# Altium project QUTMS-RADIO-GPS-V00.PrjPcb
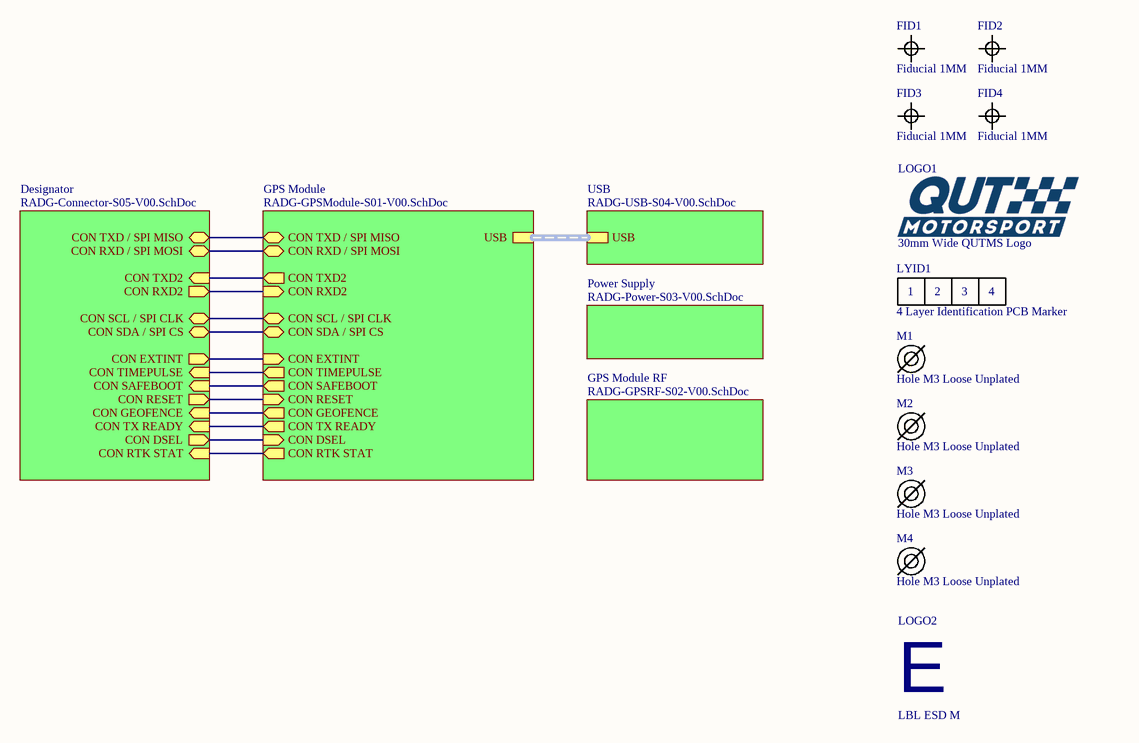
[diagram p0: RADG-Master-S00-V00.SchDoc]
6 sheets, 106 parts. Net scope: hierarchical (ports join the sheet entries above them; power ports are global).
Board file: RADG-B00-V00.PcbDoc
Sheets:
  RADG-Master-S00-V00.SchDoc
    GPS Module = RADG-GPSModule-S01-V00.SchDoc
    Power Supply = RADG-Power-S03-V00.SchDoc
    USB = RADG-USB-S04-V00.SchDoc
    Designator = RADG-Connector-S05-V00.SchDoc
    GPS Module RF = RADG-GPSRF-S02-V00.SchDoc

## Sheet RADG-Master-S00-V00.SchDoc: RADG Master (Top Level)
size A3; DrawnBy: Jonn Dillon; DocumentNumber: 1; SheetNumber: 1; SheetTotal: 6; Version: 00; Project: QUTMS RADIO GPS; PageSetup: Record=PageOptions|CenterHorizontal=True|CenterVertical=True|PrintScale=0.97|XCorrection=1.00|YCorrection=1.00|PrintKind=0|BorderSize=5000000|LeftOffset=0|BottomOffset=0|Orientation=2|PaperLength=1000|PaperWidth=1000|Scale=100|PaperSource=7|PrintQuality=-4|MediaType=1|DitherType=10|PaperKind=A4|PrintScaleMode=1

### Parts
FID1  Fiducial 1MM  [FIDUCIAL 1MM]  (no BOM)
FID2  Fiducial 1MM  [FIDUCIAL 1MM]  (no BOM)
FID3  Fiducial 1MM  [FIDUCIAL 1MM]  (no BOM)
FID4  Fiducial 1MM  [FIDUCIAL 1MM]  (no BOM)
LOGO1  30mm Wide QUTMS Logo  [QUTMS LOGO 30MM]  (no BOM)
LOGO2  LBL ESD M  [LBL ESD MEDIUM]  (no BOM)
LYID1  4 Layer Identification PCB Marker  [LAYER IDENT 4]  (no BOM)
M1  Hole M3 Loose Unplated  [M3.5 UNPLATED]  (no BOM)
M2  Hole M3 Loose Unplated  [M3.5 UNPLATED]  (no BOM)
M3  Hole M3 Loose Unplated  [M3.5 UNPLATED]  (no BOM)
M4  Hole M3 Loose Unplated  [M3.5 UNPLATED]  (no BOM)

### Sub-sheets
Designator = RADG-Connector-S05-V00.SchDoc: CON TXD / SPI MISO (bidir), CON RXD / SPI MOSI (bidir), CON TXD2 (in), CON RXD2 (out), CON SCL / SPI CLK (bidir), CON SDA / SPI CS (bidir), CON EXTINT (out), CON TIMEPULSE (in), CON SAFEBOOT (in), CON RESET (out), CON GEOFENCE (in), CON TX READY (in), CON DSEL (out), CON RTK STAT (in)
GPS Module = RADG-GPSModule-S01-V00.SchDoc: USB (harness USB), CON TX READY (out), CON DSEL (in), CON RTK STAT (out), CON SCL / SPI CLK (bidir), CON RXD2 (in), CON RESET (in), CON GEOFENCE (out), CON TXD2 (out), CON EXTINT (in), CON TIMEPULSE (out), CON SAFEBOOT (out), CON SDA / SPI CS (bidir), CON RXD / SPI MOSI (bidir), CON TXD / SPI MISO (bidir)
GPS Module RF = RADG-GPSRF-S02-V00.SchDoc: no entries
Power Supply = RADG-Power-S03-V00.SchDoc: no entries
USB = RADG-USB-S04-V00.SchDoc: USB

### Nets
CON DSEL: sheet GPS Module/CON DSEL, sheet Designator/CON DSEL
CON EXTINT: sheet GPS Module/CON EXTINT, sheet Designator/CON EXTINT
CON GEOFENCE: sheet GPS Module/CON GEOFENCE, sheet Designator/CON GEOFENCE
CON RESET: sheet GPS Module/CON RESET, sheet Designator/CON RESET
CON RTK STAT: sheet GPS Module/CON RTK STAT, sheet Designator/CON RTK STAT
CON RXD2: sheet GPS Module/CON RXD2, sheet Designator/CON RXD2
CON RXD / SPI MOSI: sheet GPS Module/CON RXD / SPI MOSI, sheet Designator/CON RXD / SPI MOSI
CON SAFEBOOT: sheet GPS Module/CON SAFEBOOT, sheet Designator/CON SAFEBOOT
CON SCL / SPI CLK: sheet GPS Module/CON SCL / SPI CLK, sheet Designator/CON SCL / SPI CLK
CON SDA / SPI CS: sheet GPS Module/CON SDA / SPI CS, sheet Designator/CON SDA / SPI CS
CON TIMEPULSE: sheet GPS Module/CON TIMEPULSE, sheet Designator/CON TIMEPULSE
CON TX READY: sheet GPS Module/CON TX READY, sheet Designator/CON TX READY
CON TXD2: sheet GPS Module/CON TXD2, sheet Designator/CON TXD2
CON TXD / SPI MISO: sheet GPS Module/CON TXD / SPI MISO, sheet Designator/CON TXD / SPI MISO

### Buses and harness runs
harness sheet GPS Module/USB = sheet USB/USB

### Notes on the sheet
- Revision History:
- Sheet Title:
- Rev
- Date
- Description
- Project:
- Size:
- Drawn By:
- A3
- Number:
- Revision:
- Sheet
- Version:
- of
- QUT Motorsport
- O-120, Gardens Point
- 2 George Street
- Brisbane, QLD 4000
- Australia
- Print Date:
- Print Time:
- File Name:
- (in symbol Layer Identification 4) 1; 2; 3; 4
- (in symbol LBL ESD M) E

### Library data of the parts
LOGO1 = QUTMS Logo 30mm
LYID1 = Layer Identification 4
M1-M4 = Hole M3 Loose Unplated: M3.5 Hole, No Plating

## Sheet RADG-GPSModule-S01-V00.SchDoc: RADG GPS Module (ZED-F9#, Powered Antenna)
size A3; DrawnBy: Jonn Dillon; DocumentNumber: 2; SheetNumber: 2; SheetTotal: 6; Version: 00; Project: QUTMS RADIO GPS; PageSetup: Record=PageOptions|CenterHorizontal=True|CenterVertical=True|PrintScale=0.97|XCorrection=1.00|YCorrection=1.00|PrintKind=0|BorderSize=5000000|LeftOffset=0|BottomOffset=0|Orientation=2|PaperLength=1000|PaperWidth=1000|Scale=100|PaperSource=7|PrintQuality=-4|MediaType=1|DitherType=10|PaperKind=A4|PrintScaleMode=1
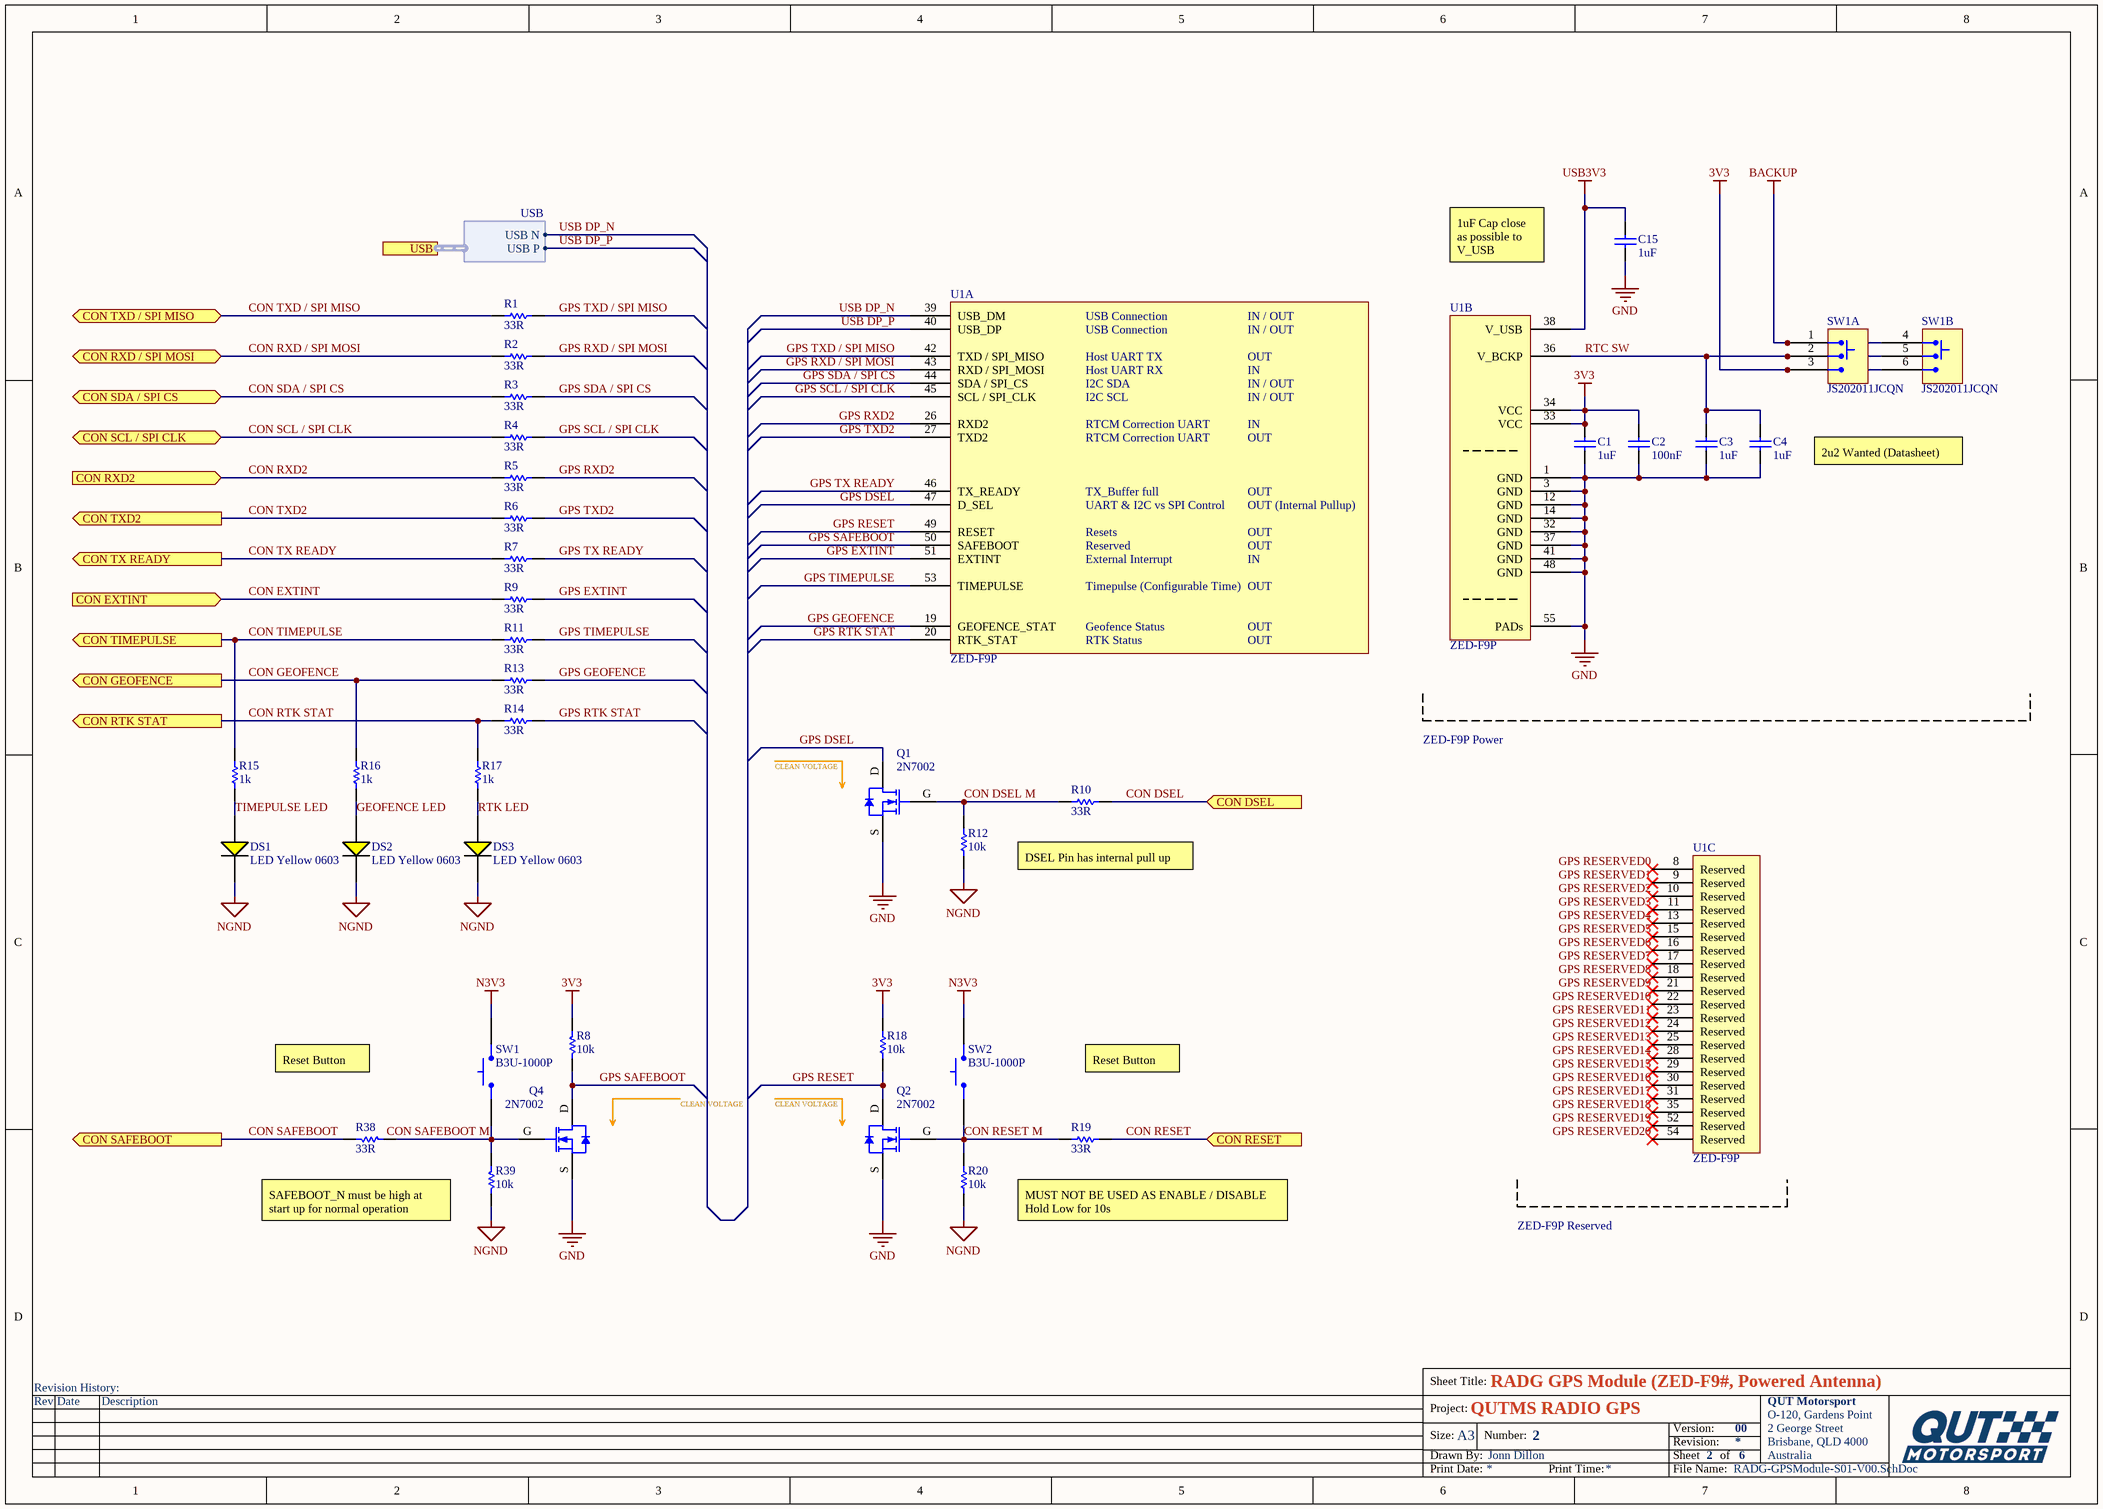
[diagram p1: RADG-GPSModule-S01-V00.SchDoc]

### Parts
(Parts that share a designator on the sheet are numbered #1, #2 ... from top to bottom, then left to right.)
C1  1uF  [Cap_Ceramic_0603]
C2  100nF  [Cap_Ceramic_0603]
C3  1uF  [Cap_Ceramic_0603]
C4  1uF  [Cap_Ceramic_0603]
C15  1uF  [Cap_Ceramic_0603]
DS1  LED Yellow 0603  [LED YELLOW 0603]
DS2  LED Yellow 0603  [LED YELLOW 0603]
DS3  LED Yellow 0603  [LED YELLOW 0603]
Q1  2N7002  [SOT23-3]
Q2  2N7002  [SOT23-3]
Q4  2N7002  [SOT23-3]
R1  33R  [Res_ThinFilm_0603]
R2  33R  [Res_ThinFilm_0603]
R3  33R  [Res_ThinFilm_0603]
R4  33R  [Res_ThinFilm_0603]
R5  33R  [Res_ThinFilm_0603]
R6  33R  [Res_ThinFilm_0603]
R7  33R  [Res_ThinFilm_0603]
R8  10k  [Res_ThinFilm_0603]
R9  33R  [Res_ThinFilm_0603]
R10  33R  [Res_ThinFilm_0603]
R11  33R  [Res_ThinFilm_0603]
R12  10k  [Res_ThinFilm_0603]
R13  33R  [Res_ThinFilm_0603]
R14  33R  [Res_ThinFilm_0603]
R15  1k  [Res_ThinFilm_0603]
R16  1k  [Res_ThinFilm_0603]
R17  1k  [Res_ThinFilm_0603]
R18  10k  [Res_ThinFilm_0603]
R19  33R  [Res_ThinFilm_0603]
R20  10k  [Res_ThinFilm_0603]
R38  33R  [Res_ThinFilm_0603]
R39  10k  [Res_ThinFilm_0603]
SW1#1  JS202011JCQN  [JS202011JCQN]  (parts A,B of 2)
SW1#2  B3U-1000P  [BTN B3U-1000P]
SW2  B3U-1000P  [BTN B3U-1000P]
U1  ZED-F9P  [uBlox_ZED-F9P]  (parts A,B,C of 4)

### Ports
CON DSEL (in), CON EXTINT (in), CON GEOFENCE (out), CON RESET (in), CON RTK STAT (out), CON RXD2 (in), CON RXD / SPI MOSI (bidir), CON SAFEBOOT (out), CON SCL / SPI CLK (bidir), CON SDA / SPI CS (bidir), CON TIMEPULSE (out), CON TX READY (out), CON TXD2 (out), CON TXD / SPI MISO (bidir), USB (harness USB)

### Harnesses
USB: USB P, USB N

### Nets
3V3: C1.2 C2.2 R8.2 R18.2 SW1#1.3 SW1#1.6 U1.33(VCC) U1.34(VCC)
BACKUP: SW1#1.1 SW1#1.4
GND: C1.1 C2.1 C3.1 C4.1 C15.1 Q1.S Q2.S Q4.S U1.1(GND) U1.3(GND) U1.12(GND) U1.14(GND) U1.32(GND) U1.37(GND) U1.41(GND) U1.48(GND) U1.55(PADs)
N3V3: SW1#2.2 SW2.2
NGND: DS1.2(C) DS2.2(C) DS3.2(C) R12.1 R20.1 R39.1
USB3V3: C15.2 U1.38(V_USB)
CON DSEL: R10.2 ; port CON DSEL
CON DSEL M: Q1.G R10.1 R12.2
CON EXTINT: R9.1 ; port CON EXTINT
CON GEOFENCE: R13.1 R16.2 ; port CON GEOFENCE
CON RESET: R19.2 ; port CON RESET
CON RESET M: Q2.G R19.1 R20.2 SW2.1
CON RTK STAT: R14.1 R17.2 ; port CON RTK STAT
CON RXD2: R5.1 ; port CON RXD2
CON RXD / SPI MOSI: R2.1 ; port CON RXD / SPI MOSI
CON SAFEBOOT: R38.2 ; port CON SAFEBOOT
CON SAFEBOOT M: Q4.G R38.1 R39.2 SW1#2.1
CON SCL / SPI CLK: R4.1 ; port CON SCL / SPI CLK
CON SDA / SPI CS: R3.1 ; port CON SDA / SPI CS
CON TIMEPULSE: R11.1 R15.2 ; port CON TIMEPULSE
CON TX READY: R7.1 ; port CON TX READY
CON TXD2: R6.1 ; port CON TXD2
CON TXD / SPI MISO: R1.1 ; port CON TXD / SPI MISO
GEOFENCE LED: DS2.1(A) R16.1
GPS DSEL: Q1.D U1.47(D_SEL)
GPS EXTINT: R9.2 U1.51(EXTINT)
GPS GEOFENCE: R13.2 U1.19(GEOFENCE_STAT)
GPS RESERVED0: U1.8(Reserved)
GPS RESERVED1: U1.9(Reserved)
GPS RESERVED2: U1.10(Reserved)
GPS RESERVED3: U1.11(Reserved)
GPS RESERVED4: U1.13(Reserved)
GPS RESERVED5: U1.15(Reserved)
GPS RESERVED6: U1.16(Reserved)
GPS RESERVED7: U1.17(Reserved)
GPS RESERVED8: U1.18(Reserved)
GPS RESERVED9: U1.21(Reserved)
GPS RESERVED10: U1.22(Reserved)
GPS RESERVED11: U1.23(Reserved)
GPS RESERVED12: U1.24(Reserved)
GPS RESERVED13: U1.25(Reserved)
GPS RESERVED14: U1.28(Reserved)
GPS RESERVED15: U1.29(Reserved)
GPS RESERVED16: U1.30(Reserved)
GPS RESERVED17: U1.31(Reserved)
GPS RESERVED18: U1.35(Reserved)
GPS RESERVED19: U1.52(Reserved)
GPS RESERVED20: U1.54(Reserved)
GPS RESET: Q2.D R18.1 U1.49(RESET)
GPS RTK STAT: R14.2 U1.20(RTK_STAT)
GPS RXD2: R5.2 U1.26(RXD2)
GPS RXD / SPI MOSI: R2.2 U1.43(RXD_/_SPI_MOSI)
GPS SAFEBOOT: Q4.D R8.1 U1.50(SAFEBOOT)
GPS SCL / SPI CLK: R4.2 U1.45(SCL_/_SPI_CLK)
GPS SDA / SPI CS: R3.2 U1.44(SDA_/_SPI_CS)
GPS TIMEPULSE: R11.2 U1.53(TIMEPULSE)
GPS TX READY: R7.2 U1.46(TX_READY)
GPS TXD2: R6.2 U1.27(TXD2)
GPS TXD / SPI MISO: R1.2 U1.42(TXD_/_SPI_MISO)
RTC SW: C3.2 C4.2 SW1#1.2 SW1#1.5 U1.36(V_BCKP)
RTK LED: DS3.1(A) R17.1
TIMEPULSE LED: DS1.1(A) R15.1
USB DP_N: U1.39(USB_DM) ; port USB.USB N
USB DP_P: U1.40(USB_DP) ; port USB.USB P

### Notes on the sheet
- 1uF Cap close as possible to V_USB
- 2u2 Wanted (Datasheet)
- CLEAN VOLTAGE
- ZED-F9P Power
- DSEL Pin has internal pull up
- Reset Button
- SAFEBOOT_N must be high at start up for normal operation
- MUST NOT BE USED AS ENABLE / DISABLE
  Hold Low for 10s
- ZED-F9P Reserved
- Revision History:
- Sheet Title:
- Rev
- Date
- Description
- Project:
- Size:
- Drawn By:
- A3
- Number:
- Revision:
- Sheet
- Version:
- of
- QUT Motorsport
- O-120, Gardens Point
- 2 George Street
- Brisbane, QLD 4000
- Australia
- Print Date:
- Print Time:
- File Name:
- (in symbol ZED-F9P, part A) USB Connection; IN / OUT; Host UART TX; OUT; Host UART RX; IN; I2C SDA; I2C SCL; RTCM Correction UART; TX_Buffer full; UART & I2C vs SPI Control; OUT (Internal Pullup); Resets; External Interrupt; Timepulse (Configurable Time); Geofence Status; RTK Status

### Library data of the parts
C1 C3 C4 C15 = 1uF 25V 5% X7R 0603: Capacitor, Ceramic, SMD, 1uF, 25V, 5%, X7R, 0603
C2 = 100nF 50V 5% X7R 0603: Capacitor, Ceramic, SMD, 100nF, 50V, 5%, X7R, 0603
R1-R7 R9-R11 R13 R14 R19 R38 = 33R 5% 0603: Resistor, SMD, 33R, 0.1W, 5%, 0603
R8 R12 R18 R20 R39 = 10k 5% 0603: Resistor, SMD, 10k, 0.1W, 5%, 0603
R15-R17 = 1k 5% 0603: Resistor, SMD, 1k, 0.1W, 5%, 0603
SW1#1 = SLIDE DPDT JS202011JCQN
SW1#2 SW2 = BTN B3U-1000P: Omron B3U-1000P Ultra Miniture Switch; ComponentLink1Description: LCSC; ComponentLink1URL: https://lcsc.com/product-detail/Tactile-Switches_BRIGHT-TSA063G50-250_C294565.html

## Sheet RADG-Power-S03-V00.SchDoc: RADG Power (Filtering, Power Sequencing, USB)
size A3; DrawnBy: Jonn Dillon; DocumentNumber: 3; SheetNumber: 5; SheetTotal: 6; Version: 00; Project: QUTMS RADIO GPS; PageSetup: Record=PageOptions|CenterHorizontal=True|CenterVertical=True|PrintScale=0.97|XCorrection=1.00|YCorrection=1.00|PrintKind=0|BorderSize=5000000|LeftOffset=0|BottomOffset=0|Orientation=2|PaperLength=1000|PaperWidth=1000|Scale=100|PaperSource=7|PrintQuality=-4|MediaType=1|DitherType=10|PaperKind=A4|PrintScaleMode=1
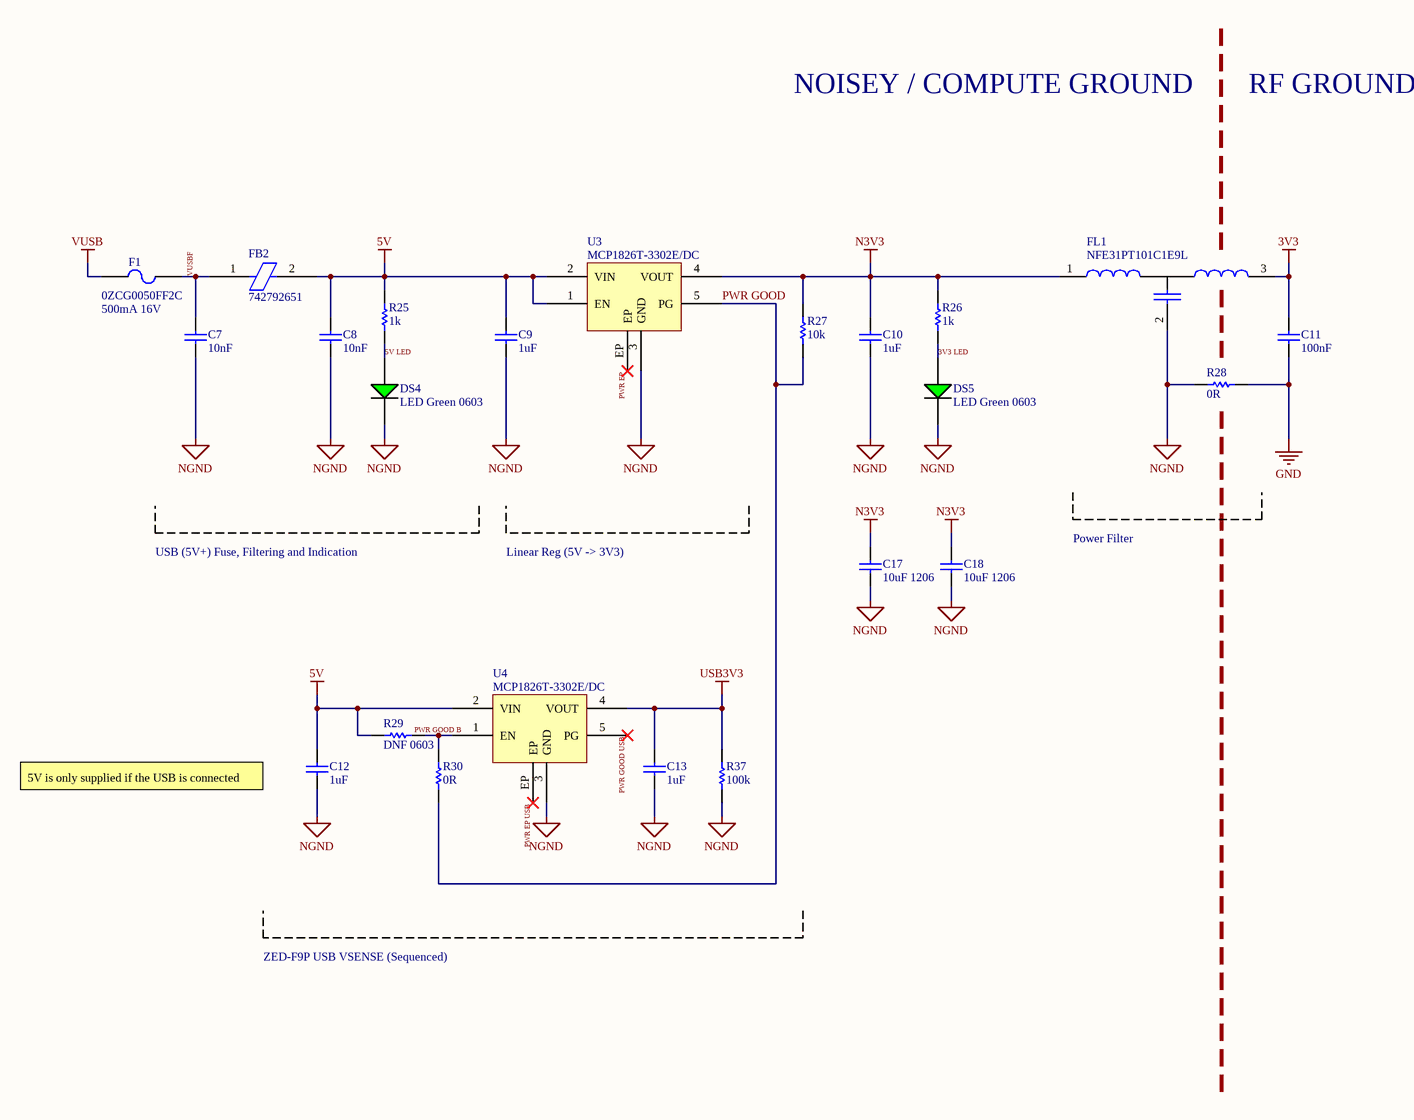
[diagram p2: RADG-Power-S03-V00.SchDoc]

### Parts
C7  10nF  [Cap_Ceramic_0603]
C8  10nF  [Cap_Ceramic_0603]
C9  1uF  [Cap_Ceramic_0603]
C10  1uF  [Cap_Ceramic_0603]
C11  100nF  [Cap_Ceramic_0603]
C12  1uF  [Cap_Ceramic_0603]
C13  1uF  [Cap_Ceramic_0603]
C17  10uF 1206  [Cap_Ceramic_1206]
C18  10uF 1206  [Cap_Ceramic_1206]
DS4  LED Green 0603  [LED GREEN 0603]
DS5  LED Green 0603  [LED GREEN 0603]
F1  0ZCG0050FF2C  [1812 FUSE]
FB2  742792651  [Inductor_0603]
FL1  NFE31PT101C1E9L  [NFE31PT101C1E9L]
R25  1k  [Res_ThinFilm_0603]
R26  1k  [Res_ThinFilm_0603]
R27  10k  [Res_ThinFilm_0603]
R28  0R  [Res_ThinFilm_0603]
R29  DNF 0603  [Res_ThinFilm_0603]
R30  0R  [Res_ThinFilm_0603]
R37  100k  [Res_ThinFilm_0603]
U3  MCP1826T-3302E/DC  [SOT-223-5]
U4  MCP1826T-3302E/DC  [SOT-223-5]

### Nets
3V3: C11.2 FL1.3
5V: C8.2 C9.2 C12.2 FB2.2 R25.2 R29.1 U3.1(EN) U3.2(VIN) U4.2(VIN)
GND: C11.1 R28.2
N3V3: C10.2 C17.2 C18.2 FL1.1 R26.2 R27.2 U3.4(VOUT)
NGND: C7.1 C8.1 C9.1 C10.1 C12.1 C13.1 C17.1 C18.1 DS4.2(C) DS5.2(C) FL1.2 R28.1 R37.1 U3.3(GND) U4.3(GND)
USB3V3: C13.2 R37.2 U4.4(VOUT)
VUSB: F1.1
3V3 LED: DS5.1(A) R26.1
5V LED: DS4.1(A) R25.1
PWR EP: U3.EP
PWR EP USB: U4.EP
PWR GOOD: R27.1 R30.1 U3.5(PG)
PWR GOOD B: R29.2 R30.2 U4.1(EN)
PWR GOOD USB: U4.5(PG)
VUSBF: C7.2 F1.2 FB2.1

### Notes on the sheet
- NOISEY / COMPUTE GROUND
- RF GROUND
- 500mA 16V
- USB (5V+) Fuse, Filtering and Indication
- Linear Reg (5V -> 3V3)
- Power Filter
- 5V is only supplied if the USB is connected
- ZED-F9P USB VSENSE (Sequenced)
- Revision History:
- Sheet Title:
- Rev
- Date
- Description
- Project:
- Size:
- Drawn By:
- A3
- Number:
- Revision:
- Sheet
- Version:
- of
- QUT Motorsport
- O-120, Gardens Point
- 2 George Street
- Brisbane, QLD 4000
- Australia
- Print Date:
- Print Time:
- File Name:

### Library data of the parts
C7 C8 = 10nF 50V 5% X7R 0603: Capacitor, Ceramic, SMD, 10nF, 50V, 5%, X7R, 0603
C9 C10 C12 C13 = 1uF 25V 5% X7R 0603: as C1 on sheet RADG-GPSModule-S01-V00
C11 = 100nF 50V 5% X7R 0603: as C2 on sheet RADG-GPSModule-S01-V00
C17 C18 = 10uF 25V 10% X7R 1206: Capacitor, Ceramic, SMD, 10uF, 25V, 10%, X7R, 1206
F1 = 0ZCG0050FF2C: Polymeric PTC Resettable Fuse 16V 500mA Ih Surface Mount 1812 (4532 Metric), Concave
FB2 = 742792651: 600 Ohms @ 100MHz 1 Signal Line Ferrite Bead 0603 (1608 Metric) 1A 200mOhm
FL1 = NFE31PT101C1E9L: LC (T-Type) EMI Filter 3rd Order Low Pass 1 Channel C = 100pF 6A 1206 (3216 Metric), 3 PC Pad
R25 R26 = 1k 5% 0603: Resistor, SMD, 1k, 0.1W, 5%, 0603
R27 = 10k 5% 0603: Resistor, SMD, 10k, 0.1W, 5%, 0603
R28 R30 = 0R 5% 0603: Resistor, SMD, 0R, 0.1W, 5%, 0603
R29 = DNF 0603: Resistor, SMD, DNF, 0.1W, 0603
R37 = 100k 5%, 0603: Resistor, SMD, 100k, 0.1W, 5%, 0603
U3 U4 = MCP1826T-3302E/DC: Linear Voltage Regulator IC Positive Fixed 1 Output 1A SOT-223-5

## Sheet RADG-USB-S04-V00.SchDoc: RADG USB (USB-C, ESD Protection)
size A3; DrawnBy: Jonn Dillon; DocumentNumber: 5; SheetNumber: 6; SheetTotal: 6; Version: 00; Project: QUTMS RADIO GPS; PageSetup: Record=PageOptions|CenterHorizontal=True|CenterVertical=True|PrintScale=0.97|XCorrection=1.00|YCorrection=1.00|PrintKind=0|BorderSize=5000000|LeftOffset=0|BottomOffset=0|Orientation=2|PaperLength=1000|PaperWidth=1000|Scale=100|PaperSource=7|PrintQuality=-4|MediaType=1|DitherType=10|PaperKind=A4|PrintScaleMode=1
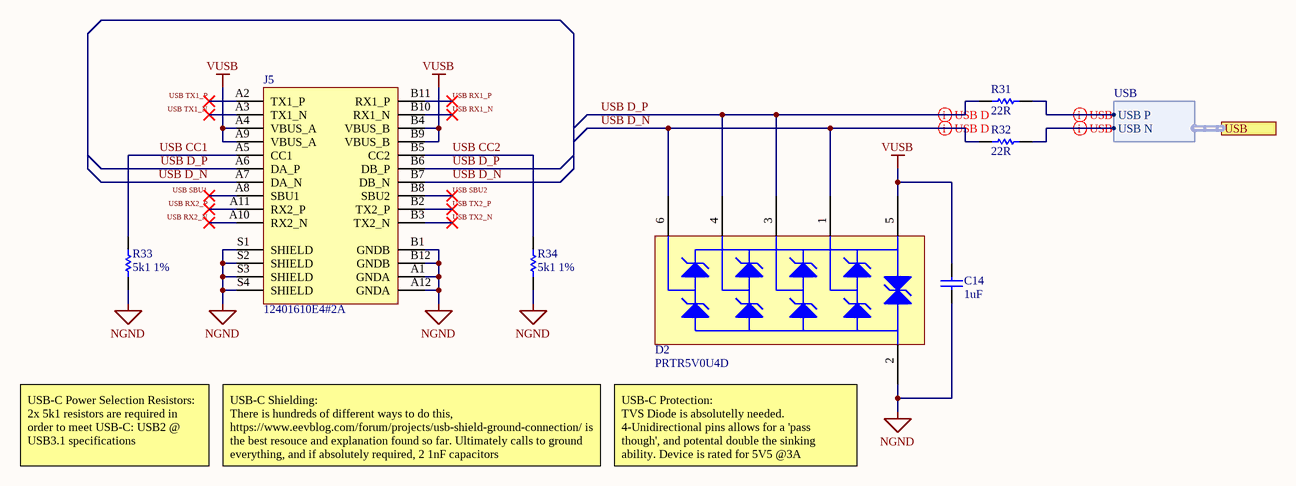
[diagram p3: RADG-USB-S04-V00.SchDoc]

### Parts
C14  1uF  [Cap_Ceramic_0603]
D2  PRTR5V0U4D  [SC-47]
J5  12401610E4#2A  [12401610E4#2A]
R31  22R  [Res_ThinFilm_0603]
R32  22R  [Res_ThinFilm_0603]
R33  5k1 1%  [Res_ThinFilm_0603]
R34  5k1 1%  [Res_ThinFilm_0603]

### Ports
USB (harness USB)

### Harnesses
USB: USB P, USB N

### Nets
NGND: C14.1 D2.2(GND) J5.A1(GNDA) J5.A12(GNDA) J5.B1(GNDB) J5.B12(GNDB) J5.S1(SHIELD) J5.S2(SHIELD) J5.S3(SHIELD) J5.S4(SHIELD) R33.1 R34.1
VUSB: C14.2 D2.5(VCC) J5.A4(VBUS_A) J5.A9(VBUS_A) J5.B4(VBUS_B) J5.B9(VBUS_B)
USB CC1: J5.A5(CC1) R33.2
USB CC2: J5.B5(CC2) R34.2
USB D_N: D2.1(P1) D2.6(P4) J5.A7(DA_N) J5.B7(DB_N) R32.1
USB D_P: D2.3(P2) D2.4(P3) J5.A6(DA_P) J5.B6(DB_P) R31.1
USB DP_N: R32.2 ; port USB.USB N
USB DP_P: R31.2 ; port USB.USB P
USB RX1_N: J5.B10(RX1_N)
USB RX1_P: J5.B11(RX1_P)
USB RX2_N: J5.A10(RX2_N)
USB RX2_P: J5.A11(RX2_P)
USB SBU1: J5.A8(SBU1)
USB SBU2: J5.B8(SBU2)
USB TX1_N: J5.A3(TX1_N)
USB TX1_P: J5.A2(TX1_P)
USB TX2_N: J5.B3(TX2_N)
USB TX2_P: J5.B2(TX2_P)

### Layout directives
differential pair: USB D_N, USB D_P, USB DP_N, USB DP_P

### Notes on the sheet
- USB-C Power Selection Resistors:
  2x 5k1 resistors are required in order to meet USB-C: USB2 @ USB3.1 specifications
- USB-C Shielding:
  There is hundreds of different ways to do this, https://www.eevblog.com/forum/projects/usb-shield-ground-connection/ is the best resouce and explanation found so far. Ultimately calls to ground everything, and if absolutely required, 2 1nF capacitors
- (near D2) USB-C Protection:
  TVS Diode is absolutelly needed. 4-Unidirectional pins allows for a 'pass though', and potental double the sinking ability. Device is rated for 5V5 @3A
- Revision History:
- Sheet Title:
- Rev
- Date
- Description
- Project:
- Size:
- Drawn By:
- A3
- Number:
- Revision:
- Sheet
- Version:
- of
- QUT Motorsport
- O-120, Gardens Point
- 2 George Street
- Brisbane, QLD 4000
- Australia
- Print Date:
- Print Time:
- File Name:

### Library data of the parts
C14 = 1uF 25V 5% X7R 0603: as C1 on sheet RADG-GPSModule-S01-V00
D2 = PRTR5V0U4D: Clamp Ipp Tvs Diode Surface Mount 6-TSOP
J5 = 12401610E4#2A: USB-C (USB TYPE-C) USB 3.2 Gen 2 (USB 3.1 Gen 2, Superspeed + (USB 3.1)) Receptacle Connector 24 Position Surface Mount, Right Angle; Through Hole
R31 R32 = 22R 5% 0603: Resistor, SMD, 22R, 0.1W, 5%, 0603
R33 R34 = 5k1 1% 0603: Resistor, SMD, 5k1, 0.1W, 1%, 0603

## Sheet RADG-Connector-S05-V00.SchDoc: RADG Connector (Logic Analyser Header, 60Pin 0.5mm FFC)
size A3; DrawnBy: Jonn Dillon; DocumentNumber: 4; SheetNumber: 3; SheetTotal: 6; Version: 00; Project: QUTMS RADIO GPS; PageSetup: Record=PageOptions|CenterHorizontal=True|CenterVertical=True|PrintScale=0.97|XCorrection=1.00|YCorrection=1.00|PrintKind=0|BorderSize=5000000|LeftOffset=0|BottomOffset=0|Orientation=2|PaperLength=1000|PaperWidth=1000|Scale=100|PaperSource=7|PrintQuality=-4|MediaType=1|DitherType=10|PaperKind=A4|PrintScaleMode=1
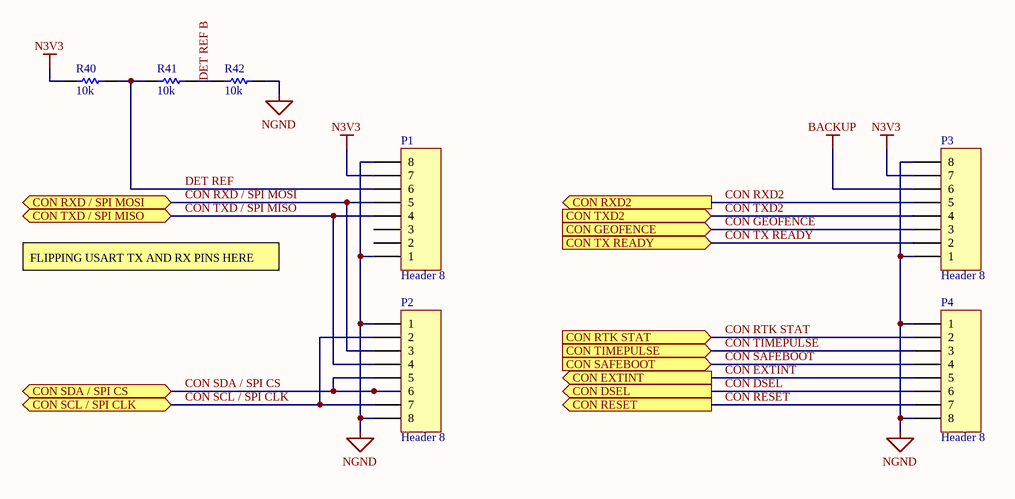
[diagram p4: RADG-Connector-S05-V00.SchDoc]

### Parts
P1  Header 8  [HDR1X8]
P2  Header 8  [HDR1X8]
P3  Header 8  [HDR1X8]
P4  Header 8  [HDR1X8]
R40  10k  [Res_ThinFilm_0603]
R41  10k  [Res_ThinFilm_0603]
R42  10k  [Res_ThinFilm_0603]

### Ports
CON DSEL (out), CON EXTINT (out), CON GEOFENCE (in), CON RESET (out), CON RTK STAT (in), CON RXD2 (out), CON RXD / SPI MOSI (bidir), CON SAFEBOOT (in), CON SCL / SPI CLK (bidir), CON SDA / SPI CS (bidir), CON TIMEPULSE (in), CON TX READY (in), CON TXD2 (in), CON TXD / SPI MISO (bidir)

### Nets
BACKUP: P3.6
N3V3: P1.7 P3.7 R40.1
NGND: P1.1 P1.8 P2.1 P2.8 P3.1 P3.8 P4.1 P4.8 R42.2
CON DSEL: P4.6 ; port CON DSEL
CON EXTINT: P4.5 ; port CON EXTINT
CON GEOFENCE: P3.3 ; port CON GEOFENCE
CON RESET: P4.7 ; port CON RESET
CON RTK STAT: P4.2 ; port CON RTK STAT
CON RXD2: P3.5 ; port CON RXD2
CON RXD / SPI MOSI: P1.5 P2.3 ; port CON RXD / SPI MOSI
CON SAFEBOOT: P4.4 ; port CON SAFEBOOT
CON SCL / SPI CLK: P2.2 P2.7 ; port CON SCL / SPI CLK
CON SDA / SPI CS: P2.5 P2.6 ; port CON SDA / SPI CS
CON TIMEPULSE: P4.3 ; port CON TIMEPULSE
CON TX READY: P3.2 ; port CON TX READY
CON TXD2: P3.4 ; port CON TXD2
CON TXD / SPI MISO: P1.4 P2.4 ; port CON TXD / SPI MISO
DET REF: P1.6 R40.2 R41.1
DET REF B: R41.2 R42.1

Not connected (* = marked no-connect by the designer): P1 2 3

### Notes on the sheet
- FLIPPING USART TX AND RX PINS HERE
- Revision History:
- Sheet Title:
- Rev
- Date
- Description
- Project:
- Size:
- Drawn By:
- A3
- Number:
- Revision:
- Sheet
- Version:
- of
- QUT Motorsport
- O-120, Gardens Point
- 2 George Street
- Brisbane, QLD 4000
- Australia
- Print Date:
- Print Time:
- File Name:

### Library data of the parts
P1-P4 = Header 8: Header, 8-Pin; LatestRevisionDate: 17-Jul-2002; LatestRevisionNote: Re-released for DXP Platform.; Publisher: Altium Limited
R40-R42 = 10k 5% 0603: Resistor, SMD, 10k, 0.1W, 5%, 0603

## Sheet RADG-GPSRF-S02-V00.SchDoc: RADG GPS Module RF (Powered Antenna, Det, Short Det, Shield)
size A3; DrawnBy: Jonn Dillon; DocumentNumber: 2; SheetNumber: 4; SheetTotal: 6; Version: 00; Project: QUTMS RADIO GPS; PageSetup: Record=PageOptions|CenterHorizontal=True|CenterVertical=True|PrintScale=0.97|XCorrection=1.00|YCorrection=1.00|PrintKind=0|BorderSize=5000000|LeftOffset=0|BottomOffset=0|Orientation=2|PaperLength=1000|PaperWidth=1000|Scale=100|PaperSource=7|PrintQuality=-4|MediaType=1|DitherType=10|PaperKind=A4|PrintScaleMode=1
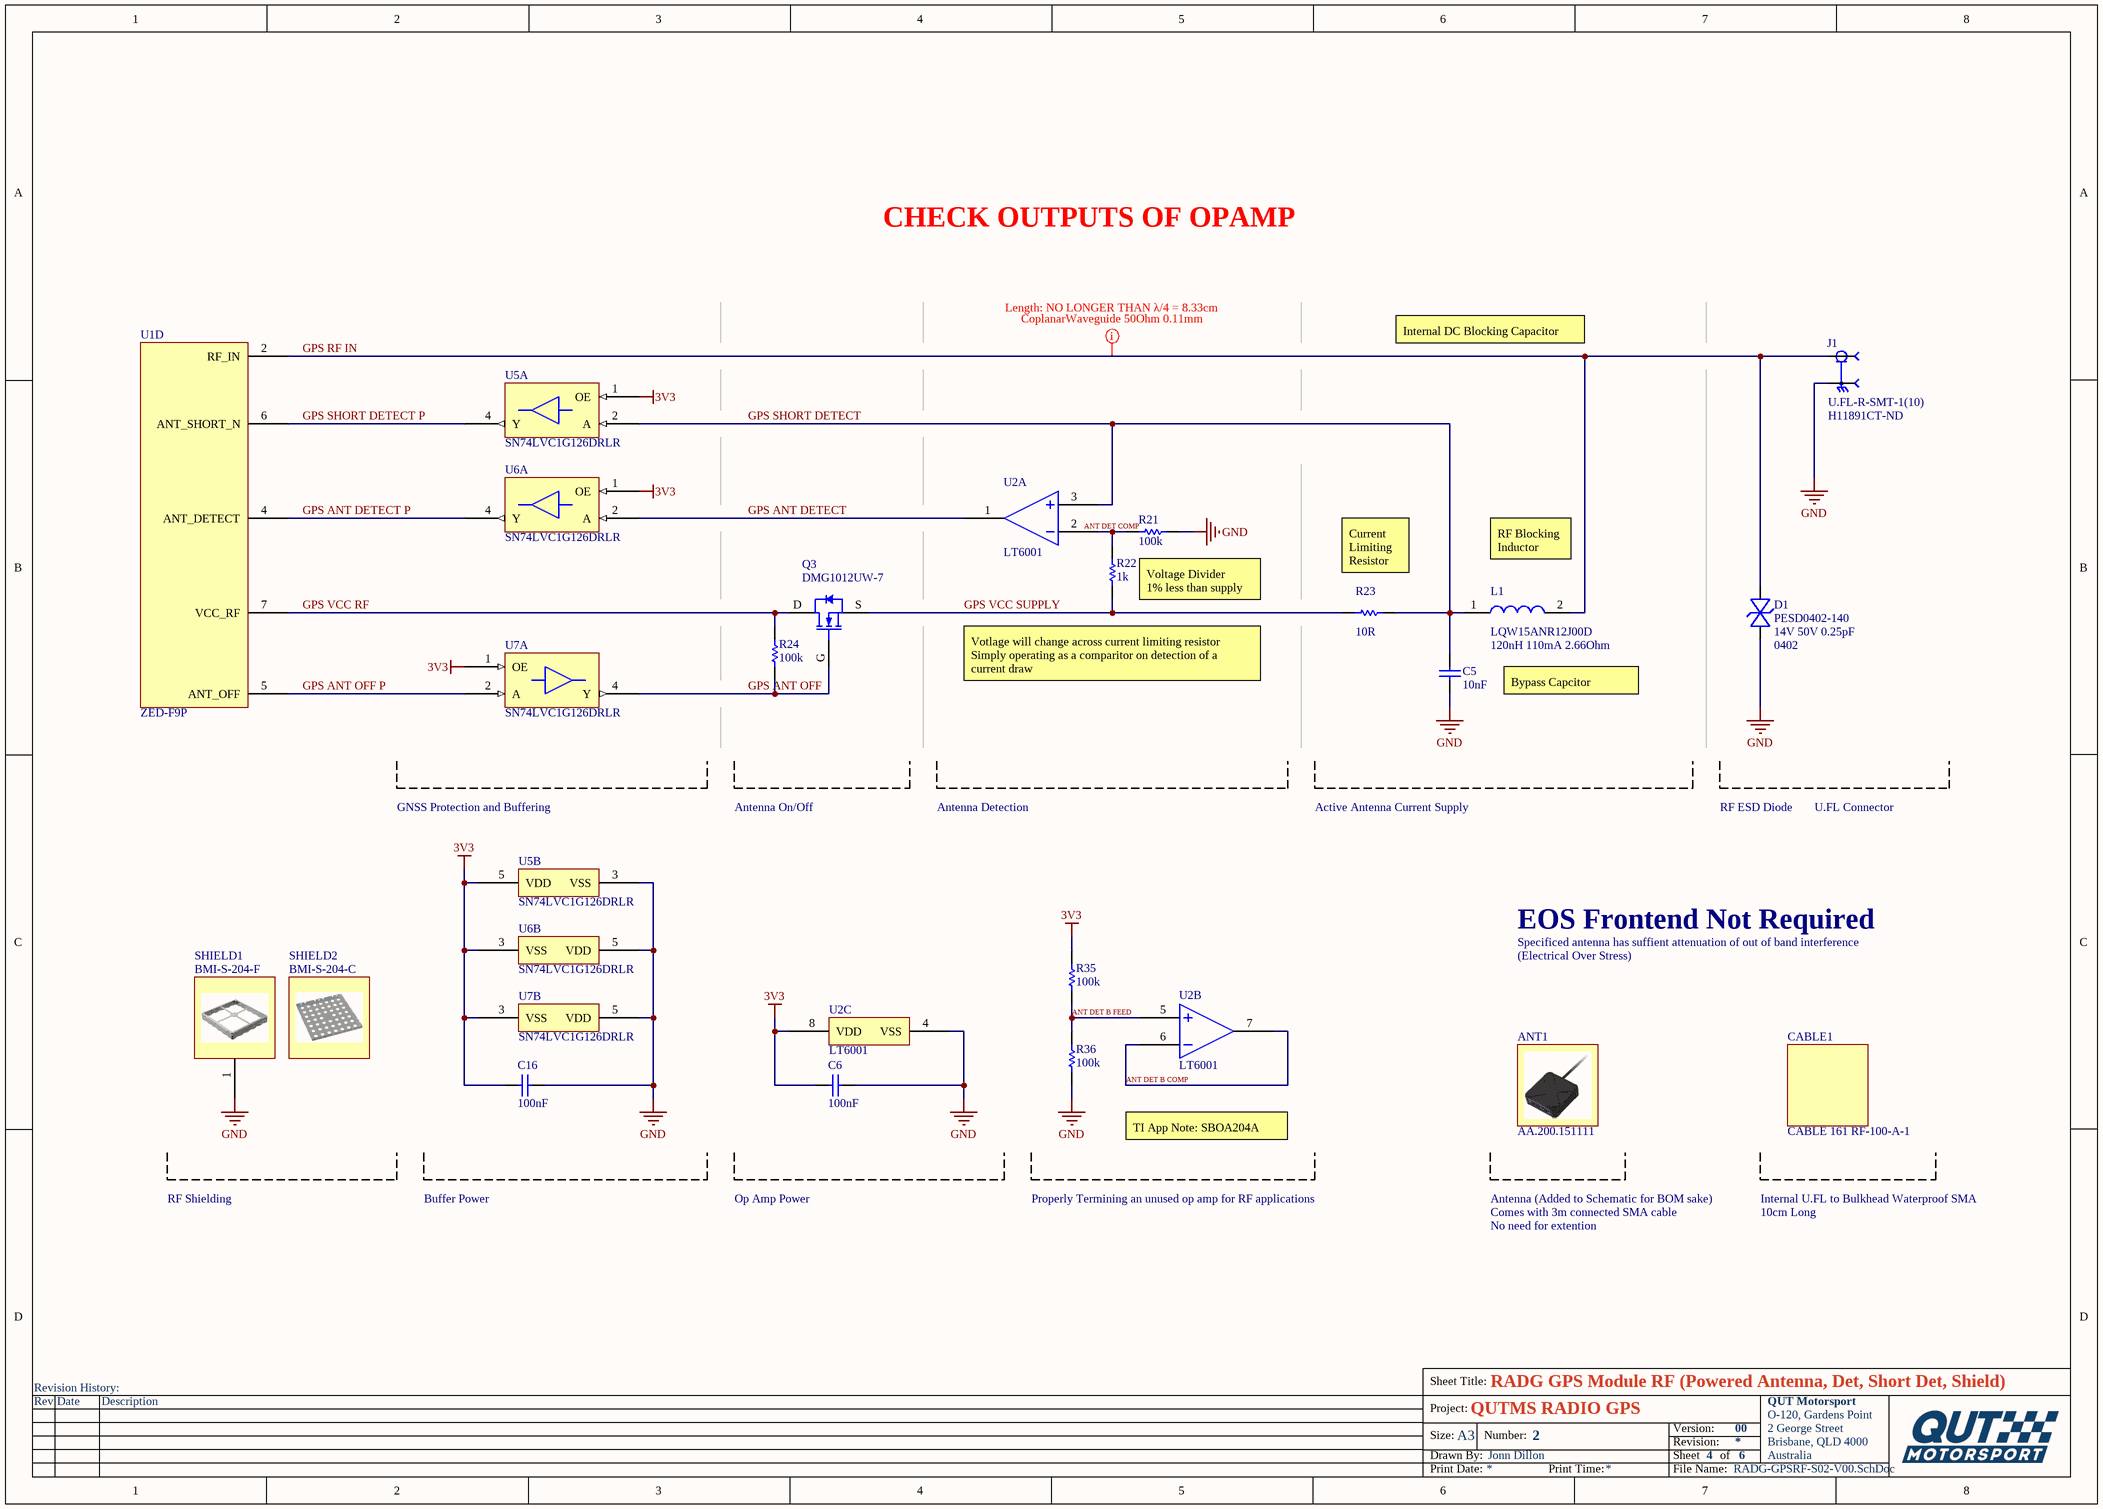
[diagram p5: RADG-GPSRF-S02-V00.SchDoc]

### Parts
ANT1  AA.200.151111
C5  10nF  [Cap_Ceramic_0603]
C6  100nF  [Cap_Ceramic_0603]
C16  100nF  [Cap_Ceramic_0603]
CABLE1  CABLE 161 RF-100-A-1
D1  PESD0402-140  [FERRITEBEAD_0402]
J1  U.FL-R-SMT-1(10)  [U.FL-R-SMT HIROSE]
L1  LQW15ANR12J00D  [FERRITEBEAD_0402]
Q3  DMG1012UW-7  [SC-70]
R21  100k  [Res_ThinFilm_0603]
R22  1k  [Res_ThinFilm_0603]
R23  10R  [Res_ThinFilm_0603]
R24  100k  [Res_ThinFilm_0603]
R35  100k  [Res_ThinFilm_0603]
R36  100k  [Res_ThinFilm_0603]
SHIELD1  BMI-S-204-F  [BMI-S-204-F]
SHIELD2  BMI-S-204-C
U1  ZED-F9P  [uBlox_ZED-F9P]  (part D of 4)
U2  LT6001  [MSOP-8]  (parts A,B,C of 3)
U5  SN74LVC1G126DRLR  [SOT-553]  (parts A,B of 2)
U6  SN74LVC1G126DRLR  [SOT-553]  (parts A,B of 2)
U7  SN74LVC1G126DRLR  [SOT-553]  (parts A,B of 2)

### Nets
3V3: C6.1 C16.1 R35.1 U2.8(VDD) U5.1(OE) U5.5(VDD) U6.1(OE) U6.3(VSS) U7.1(OE) U7.3(VSS)
GND: C5.1 C6.2 C16.2 D1.1(Anode) J1.2(GND) R21.1 R36.2 SHIELD1.1 U2.4(VSS) U5.3(VSS) U6.5(VDD) U7.5(VDD)
ANT DET B COMP: U2.6(IN2-) U2.7(OUT1)
ANT DET B FEED: R35.2 R36.1 U2.5(IN2+)
ANT DET COMP: R21.2 R22.2 U2.2(IN1-)
GPS ANT DETECT: U2.1(OUT1) U6.2(A)
GPS ANT DETECT P: U1.4(ANT_DETECT) U6.4(Y)
GPS ANT OFF: Q3.G R24.1 U7.4(Y)
GPS ANT OFF P: U1.5(ANT_OFF) U7.2(A)
GPS RF IN: D1.2(Cathode) J1.1(SIG) L1.2 U1.2(RF_IN)
GPS SHORT DETECT: C5.2 L1.1 R23.2 U2.3(IN1+) U5.2(A)
GPS SHORT DETECT P: U1.6(ANT_SHORT_N) U5.4(Y)
GPS VCC RF: Q3.D R24.2 U1.7(VCC_RF)
GPS VCC SUPPLY: Q3.S R22.1 R23.1

### Layout directives
rule Width Constraint [Pref Width = 9mil    Min Width = 9mil    Max Width = 9mil]; rule Impedance Constraint [Min = 49.50    Max = 50.50    ]; rule Clearance Constraint [Clearance = 14.5mil]: GPS RF IN

### Notes on the sheet
- CHECK OUTPUTS OF OPAMP
- Length: NO LONGER THAN λ/4 = 8.33cm
- Internal DC Blocking Capacitor
- (near J1) H11891CT-ND
- (near R23) Current Limiting Resistor
- RF Blocking Inductor
- Voltage Divider
  1% less than supply
- 120nH 110mA 2.66Ohm
- (near D1) 14V 50V 0.25pF
- (near D1) 0402
- (near R22) Votlage will change across current limiting resistor
  Simply operating as a comparitor on detection of a current draw
- Bypass Capcitor
- GNSS Protection and Buffering
- Antenna On/Off
- Antenna Detection
- Active Antenna Current Supply
- RF ESD Diode
- U.FL Connector
- Specificed antenna has suffient attenuation of out of band interference
- EOS Frontend Not Required
- (Electrical Over Stress)
- TI App Note: SBOA204A
- RF Shielding
- Buffer Power
- Op Amp Power
- Properly Termining an unused op amp for RF applications
- Antenna (Added to Schematic for BOM sake)
- Comes with 3m connected SMA cable
- No need for extention
- Internal U.FL to Bulkhead Waterproof SMA
- 10cm Long
- Revision History:
- Sheet Title:
- Rev
- Date
- Description
- Project:
- Size:
- Drawn By:
- A3
- Number:
- Revision:
- Sheet
- Version:
- of
- QUT Motorsport
- O-120, Gardens Point
- 2 George Street
- Brisbane, QLD 4000
- Australia
- Print Date:
- Print Time:
- File Name:

### Library data of the parts
ANT1 = AA.200.151111: Antennas GNSS L1/L2/L5 External 1500mm RG-174 SMA(M) ST
C5 = 10nF 50V 5% X7R 0603: as C7 on sheet RADG-Power-S03-V00
C6 C16 = 100nF 50V 5% X7R 0603: as C2 on sheet RADG-GPSModule-S01-V00
CABLE1 = CABLE 161 RF-100-A-1: Cable Assembly Coaxial U.FL (UMCC), IPEX MHF1 to SMA Female to Female RG-178 3.937" (100.00mm)
D1 = PESD0402-140: 40V Clamp Ipp Tvs Diode Surface Mount 0402
J1 = U.FL-R-SMT-1(10): U.FL (UMCC) Connector Receptacle, Male Pin 50Ohm Surface Mount Solder,  H11891CT-ND
L1 = LQW15ANR12J00D: 120nH Unshielded Wirewound Inductor 110mA 2.66Ohm Max 0402 (1005 Metric)
Q3 = DMG1012UW-7: N-Channel 20V 1A (Ta) 290mW (Ta) Surface Mount SOT-323
R21 R24 R35 R36 = 100k 5%, 0603: Resistor, SMD, 100k, 0.1W, 5%, 0603
R22 = 1k 5% 0603: Resistor, SMD, 1k, 0.1W, 5%, 0603
R23 = 10R 5% 0603: Resistor, SMD, 10R, 0.1W, 5%, 0603
SHIELD1 = BMI-S-204-F: RF Shield Frame 1.260" (32.00mm) X 1.260" (32.00mm) Solder
SHIELD2 = BMI-S-204-C: RF Shield Cover 1.344" (34.14mm) X 1.468" (37.29mm) Vent Holes in Pattern Snap Fit
U2 = LT6001: General Purpose Amplifier 2 Circuit Rail-to-Rail 8-MSOP
U5-U7 = SN74LVC1G126DRLR: Buffer, Non-Inverting 1 Element 1 Bit per Element 3-State Output SOT-5

## Nets that join several sheets
3V3: RADG-GPSModule-S01-V00 (8 pins), RADG-Power-S03-V00 (C11.2 FL1.3), RADG-GPSRF-S02-V00 (10 pins)
BACKUP: RADG-GPSModule-S01-V00 (SW1#1.1 SW1#1.4), RADG-Connector-S05-V00 (P3.6)
GND: RADG-GPSModule-S01-V00 (17 pins), RADG-Power-S03-V00 (C11.1 R28.2), RADG-GPSRF-S02-V00 (12 pins)
N3V3: RADG-GPSModule-S01-V00 (SW1#2.2 SW2.2), RADG-Power-S03-V00 (7 pins), RADG-Connector-S05-V00 (P1.7 P3.7 R40.1)
NGND: RADG-GPSModule-S01-V00 (6 pins), RADG-Power-S03-V00 (15 pins), RADG-USB-S04-V00 (12 pins), RADG-Connector-S05-V00 (9 pins)
USB3V3: RADG-GPSModule-S01-V00 (C15.2 U1.38), RADG-Power-S03-V00 (C13.2 R37.2 U4.4)
VUSB: RADG-Power-S03-V00 (F1.1), RADG-USB-S04-V00 (6 pins)
CON DSEL: RADG-GPSModule-S01-V00 (R10.2), RADG-Connector-S05-V00 (P4.6)
CON EXTINT: RADG-GPSModule-S01-V00 (R9.1), RADG-Connector-S05-V00 (P4.5)
CON GEOFENCE: RADG-GPSModule-S01-V00 (R13.1 R16.2), RADG-Connector-S05-V00 (P3.3)
CON RESET: RADG-GPSModule-S01-V00 (R19.2), RADG-Connector-S05-V00 (P4.7)
CON RTK STAT: RADG-GPSModule-S01-V00 (R14.1 R17.2), RADG-Connector-S05-V00 (P4.2)
CON RXD2: RADG-GPSModule-S01-V00 (R5.1), RADG-Connector-S05-V00 (P3.5)
CON RXD / SPI MOSI: RADG-GPSModule-S01-V00 (R2.1), RADG-Connector-S05-V00 (P1.5 P2.3)
CON SAFEBOOT: RADG-GPSModule-S01-V00 (R38.2), RADG-Connector-S05-V00 (P4.4)
CON SCL / SPI CLK: RADG-GPSModule-S01-V00 (R4.1), RADG-Connector-S05-V00 (P2.2 P2.7)
CON SDA / SPI CS: RADG-GPSModule-S01-V00 (R3.1), RADG-Connector-S05-V00 (P2.5 P2.6)
CON TIMEPULSE: RADG-GPSModule-S01-V00 (R11.1 R15.2), RADG-Connector-S05-V00 (P4.3)
CON TX READY: RADG-GPSModule-S01-V00 (R7.1), RADG-Connector-S05-V00 (P3.2)
CON TXD2: RADG-GPSModule-S01-V00 (R6.1), RADG-Connector-S05-V00 (P3.4)
CON TXD / SPI MISO: RADG-GPSModule-S01-V00 (R1.1), RADG-Connector-S05-V00 (P1.4 P2.4)
USB DP_N: RADG-GPSModule-S01-V00 (U1.39), RADG-USB-S04-V00 (R32.2)
USB DP_P: RADG-GPSModule-S01-V00 (U1.40), RADG-USB-S04-V00 (R31.2)